# Altium schematic sheet charging.SchDoc
size B
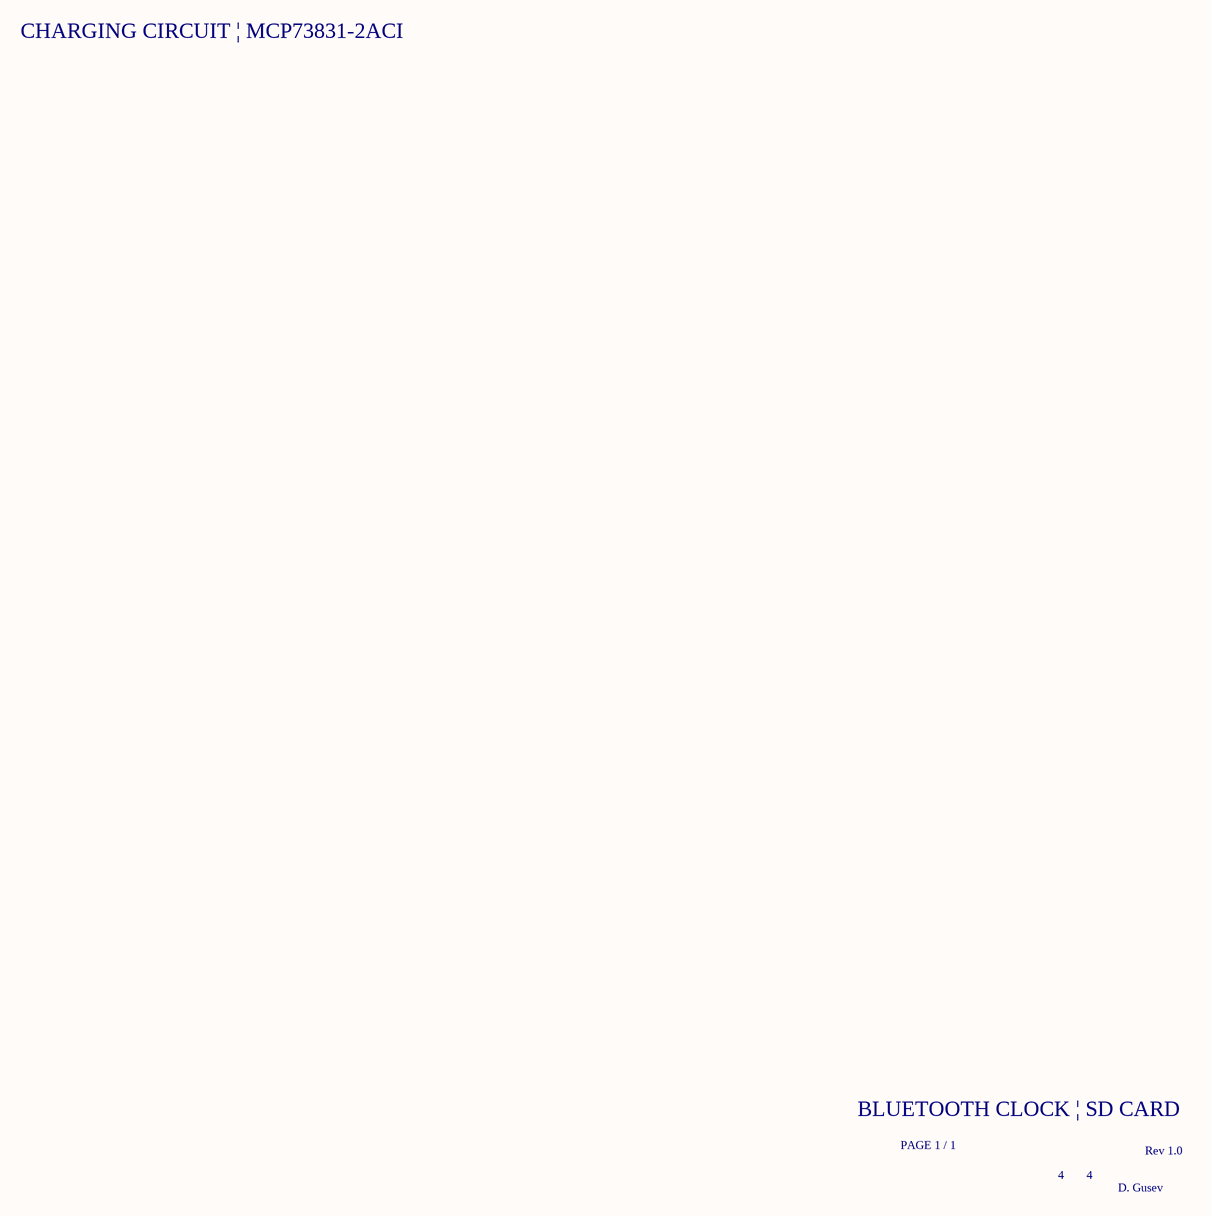
[diagram p0: charging.SchDoc]

## Notes on the sheet
- CHARGING CIRCUIT | MCP73831-2ACI
- BLUETOOTH CLOCK | SD CARD
- PAGE 1 / 1
- 4
- Rev 1.0
- D. Gusev